# EAGLE schematic iob9bvrs (EAGLE 6.6.0)

## Sheet 1 of 7
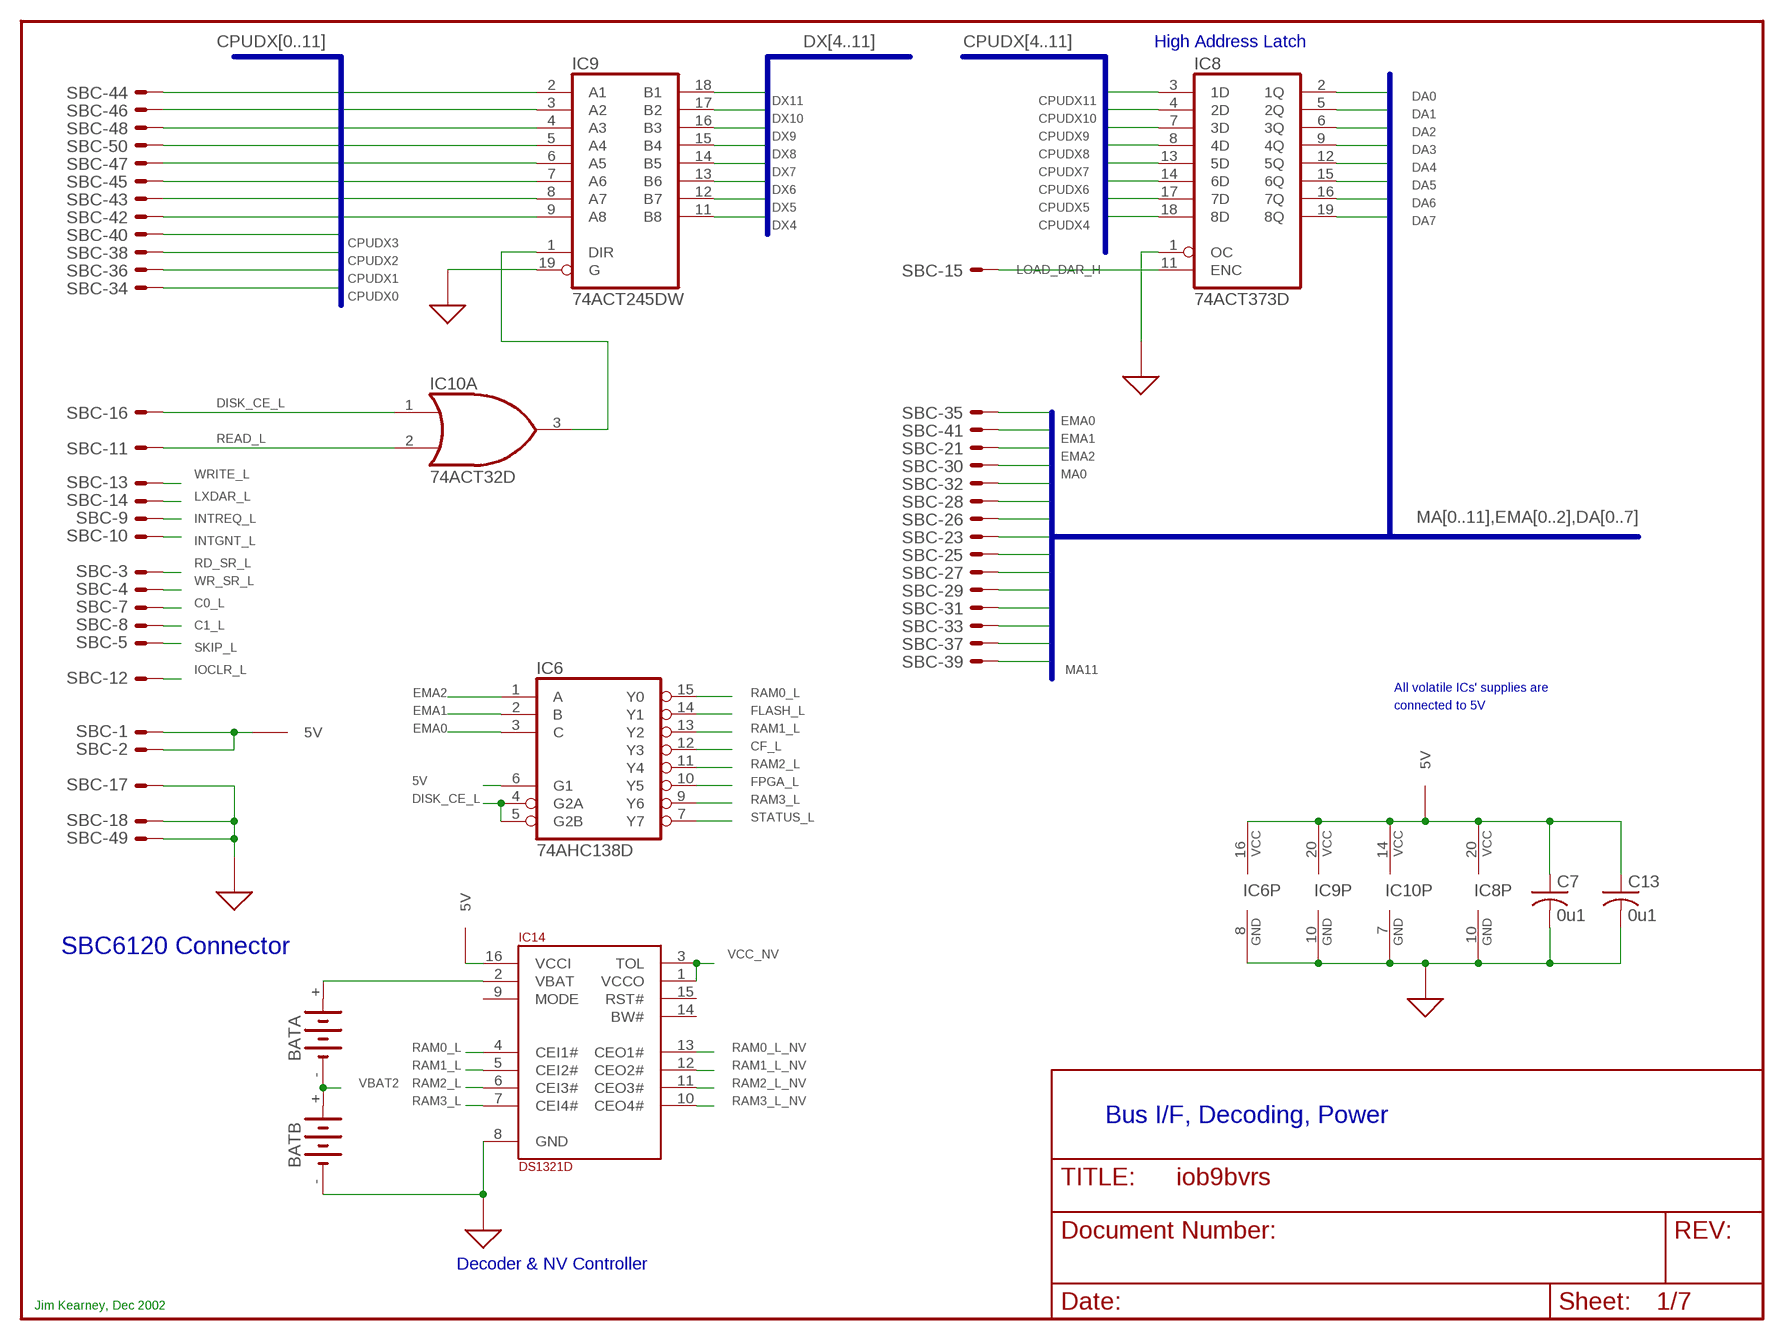
[diagram p0: schematic, sheet 1]

### Parts
BATA  CR2032HOLDER  [CR2032HOLDER]
BATB  CR2032HOLDER  [CR2032HOLDER]
C7  0u1  C-USC0805  [C0805]
C13  0u1  C-USC0805  [C0805]
IC6  74AHC138D  74LS138D  [SO16]
IC8  74ACT373D  74LS373DW  [SO20W]
IC9  74ACT245DW  74LS245DW  [SO20W]
IC10  74ACT32D  74LS32D  [SO14]
IC14  DS1321D  [SO16]
SBC  ML50E  [ML50]

### Nets
5V [power]: C7.1 C13.1 IC6.6(G1) IC6.16(VCC) IC8.20(VCC) IC9.20(VCC) IC10.14(P:VCC) IC14.16(VCCI) SBC.1 SBC.2 ; also sheet 2,3,4,5,6
C0_L: SBC.7 ; also sheet 4
C1_L: SBC.8 ; also sheet 4
CF_L: IC6.12(Y3) ; also sheet 3
CPUDX0: SBC.34 ; also sheet 4,5
CPUDX1: SBC.36 ; also sheet 4,5
CPUDX2: SBC.38 ; also sheet 4,5
CPUDX3: SBC.40 ; also sheet 4,5
CPUDX4: IC8.18(8D) IC9.9(A8) SBC.42 ; also sheet 3,5
CPUDX5: IC8.17(7D) IC9.8(A7) SBC.43 ; also sheet 3,5
CPUDX6: IC8.14(6D) IC9.7(A6) SBC.45 ; also sheet 3,5
CPUDX7: IC8.13(5D) IC9.6(A5) SBC.47 ; also sheet 3,5
CPUDX8: IC8.8(4D) IC9.5(A4) SBC.50 ; also sheet 3,5
CPUDX9: IC8.7(3D) IC9.4(A3) SBC.48 ; also sheet 3,5
CPUDX10: IC8.4(2D) IC9.3(A2) SBC.46 ; also sheet 3,5
CPUDX11: IC8.3(1D) IC9.2(A1) SBC.44 ; also sheet 3,5
DA0: IC8.2(1Q) ; also sheet 2
DA1: IC8.5(2Q) ; also sheet 2
DA2: IC8.6(3Q) ; also sheet 2
DA3: IC8.9(4Q) ; also sheet 2
DA4: IC8.12(5Q) ; also sheet 2
DA5: IC8.15(6Q) ; also sheet 2
DA6: IC8.16(7Q) ; also sheet 2
DA7: IC8.19(8Q)
DISK_CE_L: IC6.4(G2A) IC6.5(G2B) IC10.1(A:I0) SBC.16
DX4: IC9.11(B8) ; also sheet 2,3
DX5: IC9.12(B7) ; also sheet 2,3
DX6: IC9.13(B6) ; also sheet 2,3
DX7: IC9.14(B5) ; also sheet 2,3
DX8: IC9.15(B4) ; also sheet 2,3
DX9: IC9.16(B3) ; also sheet 2,3
DX10: IC9.17(B2) ; also sheet 2,3
DX11: IC9.18(B1) ; also sheet 2,3
EMA0: IC6.3(C) SBC.35
EMA1: IC6.2(B) SBC.41
EMA2: IC6.1(A) SBC.21
FLASH_L: IC6.14(Y1) ; also sheet 2
FPGA_L: IC6.10(Y5) ; also sheet 3
GND [gnd]: BATB.- C7.2 C13.2 IC6.8(GND) IC8.1(OC) IC8.10(GND) IC9.10(GND) IC9.19(G) IC10.7(P:GND) IC14.8(GND) SBC.17 SBC.18 SBC.49 ; also sheet 2,3,4,5,6,7
INTGNT_L: SBC.10 ; also sheet 4
INTREQ_L: SBC.9 ; also sheet 4
IOCLR_L: SBC.12 ; also sheet 2,4
LOAD_DAR_H: IC8.11(ENC) SBC.15
LXDAR_L: SBC.14 ; also sheet 4
MA0: SBC.30 ; also sheet 2
MA1: SBC.32 ; also sheet 2
MA2: SBC.28 ; also sheet 2
MA3: SBC.26 ; also sheet 2
MA4: SBC.23 ; also sheet 2
MA5: SBC.25 ; also sheet 2
MA6: SBC.27 ; also sheet 2
MA7: SBC.29 ; also sheet 2
MA8: SBC.31 ; also sheet 2
MA9: SBC.33 ; also sheet 2,3
MA10: SBC.37 ; also sheet 2,3
MA11: SBC.39 ; also sheet 2,3
N$2: BATA.+ IC14.2(VBAT)
N$91: IC9.1(DIR) IC10.3(A:O)
RAM0_L: IC6.15(Y0) IC14.4(CEI1#)
RAM0_L_NV: IC14.13(CEO1#) ; also sheet 2
RAM1_L: IC6.13(Y2) IC14.5(CEI2#)
RAM1_L_NV: IC14.12(CEO2#) ; also sheet 2
RAM2_L: IC6.11(Y4) IC14.6(CEI3#)
RAM2_L_NV: IC14.11(CEO3#) ; also sheet 2
RAM3_L: IC6.9(Y6) IC14.7(CEI4#)
RAM3_L_NV: IC14.10(CEO4#) ; also sheet 2
RD_SR_L: SBC.3 ; also sheet 4
READ_L: IC10.2(A:I1) SBC.11 ; also sheet 2,3,4
SKIP_L: SBC.5 ; also sheet 4
STATUS_L: IC6.7(Y7) ; also sheet 3
VBAT2: BATA.- BATB.+ ; also sheet 6
VCC_NV [power]: IC14.1(VCCO) IC14.3(TOL) ; also sheet 2
WR_SR_L: SBC.4 ; also sheet 4
WRITE_L: SBC.13 ; also sheet 2,3,4
Unconnected: IC14.9(MODE) IC14.14(BW#) IC14.15(RST#) SBC.6 SBC.19 SBC.20 SBC.22 SBC.24

### Buses
DX[4..11]
MA[0..11],EMA[0..2],DA[0..7]
CPUDX[0..11]
CPUDX[4..11]

### Notes on the sheet
- High Address Latch
- All volatile ICs' supplies are
- connected to 5V
- SBC6120 Connector
- Bus I/F, Decoding, Power
- Decoder & NV Controller
- Jim Kearney, Dec 2002

## Sheet 2 of 7
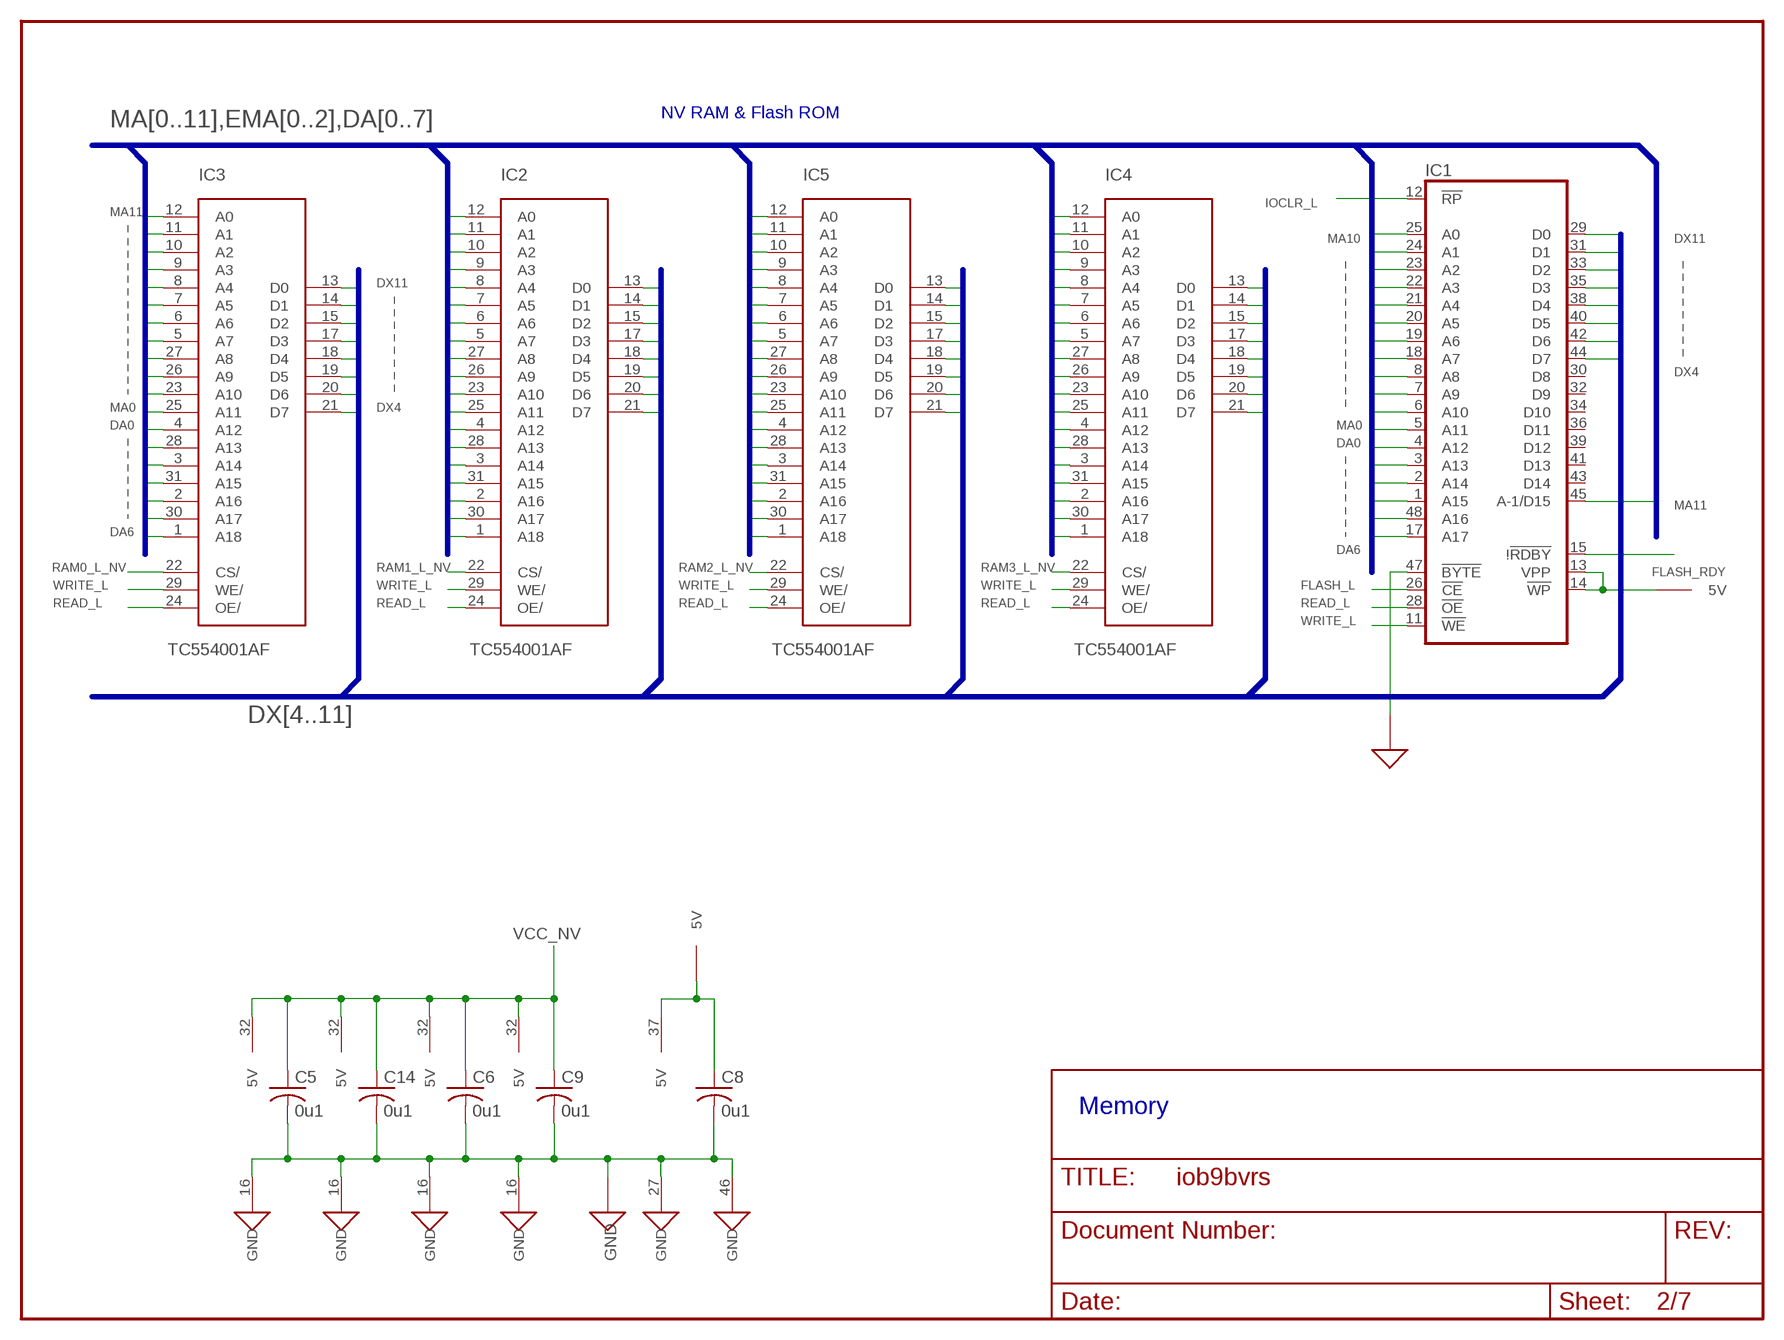
[diagram p1: schematic, sheet 2]

### Parts
C5  0u1  C-USC0805  [C0805]
C6  0u1  C-USC0805  [C0805]
C8  0u1  C-USC0805  [C0805]
C9  0u1  C-USC0805  [C0805]
C14  0u1  C-USC0805  [C0805]
IC1  LH28F400BVHE-BL  LH28F400  [TSOP48]
IC2  TC554001AF  [SOP32]
IC3  TC554001AF  [SOP32]
IC4  TC554001AF  [SOP32]
IC5  TC554001AF  [SOP32]

### Nets
5V [power]: C8.1 IC1.13(VPP) IC1.14(!WP) IC1.37(5V) ; also sheet 1,3,4,5,6
DA0: IC1.5(A11) IC2.4(A12) IC3.4(A12) IC4.4(A12) IC5.4(A12) ; also sheet 1
DA1: IC1.4(A12) IC2.28(A13) IC3.28(A13) IC4.28(A13) IC5.28(A13) ; also sheet 1
DA2: IC1.3(A13) IC2.3(A14) IC3.3(A14) IC4.3(A14) IC5.3(A14) ; also sheet 1
DA3: IC1.2(A14) IC2.31(A15) IC3.31(A15) IC4.31(A15) IC5.31(A15) ; also sheet 1
DA4: IC1.1(A15) IC2.2(A16) IC3.2(A16) IC4.2(A16) IC5.2(A16) ; also sheet 1
DA5: IC1.48(A16) IC2.30(A17) IC3.30(A17) IC4.30(A17) IC5.30(A17) ; also sheet 1
DA6: IC1.17(A17) IC2.1(A18) IC3.1(A18) IC4.1(A18) IC5.1(A18) ; also sheet 1
DX4: IC1.44(D7) IC2.21(D7) IC3.21(D7) IC4.21(D7) IC5.21(D7) ; also sheet 1,3
DX5: IC1.42(D6) IC2.20(D6) IC3.20(D6) IC4.20(D6) IC5.20(D6) ; also sheet 1,3
DX6: IC1.40(D5) IC2.19(D5) IC3.19(D5) IC4.19(D5) IC5.19(D5) ; also sheet 1,3
DX7: IC1.38(D4) IC2.18(D4) IC3.18(D4) IC4.18(D4) IC5.18(D4) ; also sheet 1,3
DX8: IC1.35(D3) IC2.17(D3) IC3.17(D3) IC4.17(D3) IC5.17(D3) ; also sheet 1,3
DX9: IC1.33(D2) IC2.15(D2) IC3.15(D2) IC4.15(D2) IC5.15(D2) ; also sheet 1,3
DX10: IC1.31(D1) IC2.14(D1) IC3.14(D1) IC4.14(D1) IC5.14(D1) ; also sheet 1,3
DX11: IC1.29(D0) IC2.13(D0) IC3.13(D0) IC4.13(D0) IC5.13(D0) ; also sheet 1,3
FLASH_L: IC1.26(!CE) ; also sheet 1
FLASH_RDY: IC1.15(!!RDBY) ; also sheet 3
GND [gnd]: C5.2 C6.2 C8.2 C9.2 C14.2 IC1.27(GND) IC1.46(GND) IC1.47(!BYTE) IC2.16(GND) IC3.16(GND) IC4.16(GND) IC5.16(GND) ; also sheet 1,3,4,5,6,7
IOCLR_L: IC1.12(!RP) ; also sheet 1,4
MA0: IC1.6(A10) IC2.25(A11) IC3.25(A11) IC4.25(A11) IC5.25(A11) ; also sheet 1
MA1: IC1.7(A9) IC2.23(A10) IC3.23(A10) IC4.23(A10) IC5.23(A10) ; also sheet 1
MA2: IC1.8(A8) IC2.26(A9) IC3.26(A9) IC4.26(A9) IC5.26(A9) ; also sheet 1
MA3: IC1.18(A7) IC2.27(A8) IC3.27(A8) IC4.27(A8) IC5.27(A8) ; also sheet 1
MA4: IC1.19(A6) IC2.5(A7) IC3.5(A7) IC4.5(A7) IC5.5(A7) ; also sheet 1
MA5: IC1.20(A5) IC2.6(A6) IC3.6(A6) IC4.6(A6) IC5.6(A6) ; also sheet 1
MA6: IC1.21(A4) IC2.7(A5) IC3.7(A5) IC4.7(A5) IC5.7(A5) ; also sheet 1
MA7: IC1.22(A3) IC2.8(A4) IC3.8(A4) IC4.8(A4) IC5.8(A4) ; also sheet 1
MA8: IC1.23(A2) IC2.9(A3) IC3.9(A3) IC4.9(A3) IC5.9(A3) ; also sheet 1
MA9: IC1.24(A1) IC2.10(A2) IC3.10(A2) IC4.10(A2) IC5.10(A2) ; also sheet 1,3
MA10: IC1.25(A0) IC2.11(A1) IC3.11(A1) IC4.11(A1) IC5.11(A1) ; also sheet 1,3
MA11: IC1.45(A-1/D15) IC2.12(A0) IC3.12(A0) IC4.12(A0) IC5.12(A0) ; also sheet 1,3
RAM0_L_NV: IC3.22(CS/) ; also sheet 1
RAM1_L_NV: IC2.22(CS/) ; also sheet 1
RAM2_L_NV: IC5.22(CS/) ; also sheet 1
RAM3_L_NV: IC4.22(CS/) ; also sheet 1
READ_L: IC1.28(!OE) IC2.24(OE/) IC3.24(OE/) IC4.24(OE/) IC5.24(OE/) ; also sheet 1,3,4
VCC_NV [power]: C5.1 C6.1 C9.1 C14.1 IC2.32(5V) IC3.32(5V) IC4.32(5V) IC5.32(5V) ; also sheet 1
WRITE_L: IC1.11(!WE) IC2.29(WE/) IC3.29(WE/) IC4.29(WE/) IC5.29(WE/) ; also sheet 1,3,4
Unconnected: IC1.30(D8) IC1.32(D9) IC1.34(D10) IC1.36(D11) IC1.39(D12) IC1.41(D13) IC1.43(D14)

### Buses
MA[0..11],EMA[0..2],DA[0..7]
DX[4..11]

### Notes on the sheet
- NV RAM & Flash ROM
- Memory

## Sheet 3 of 7
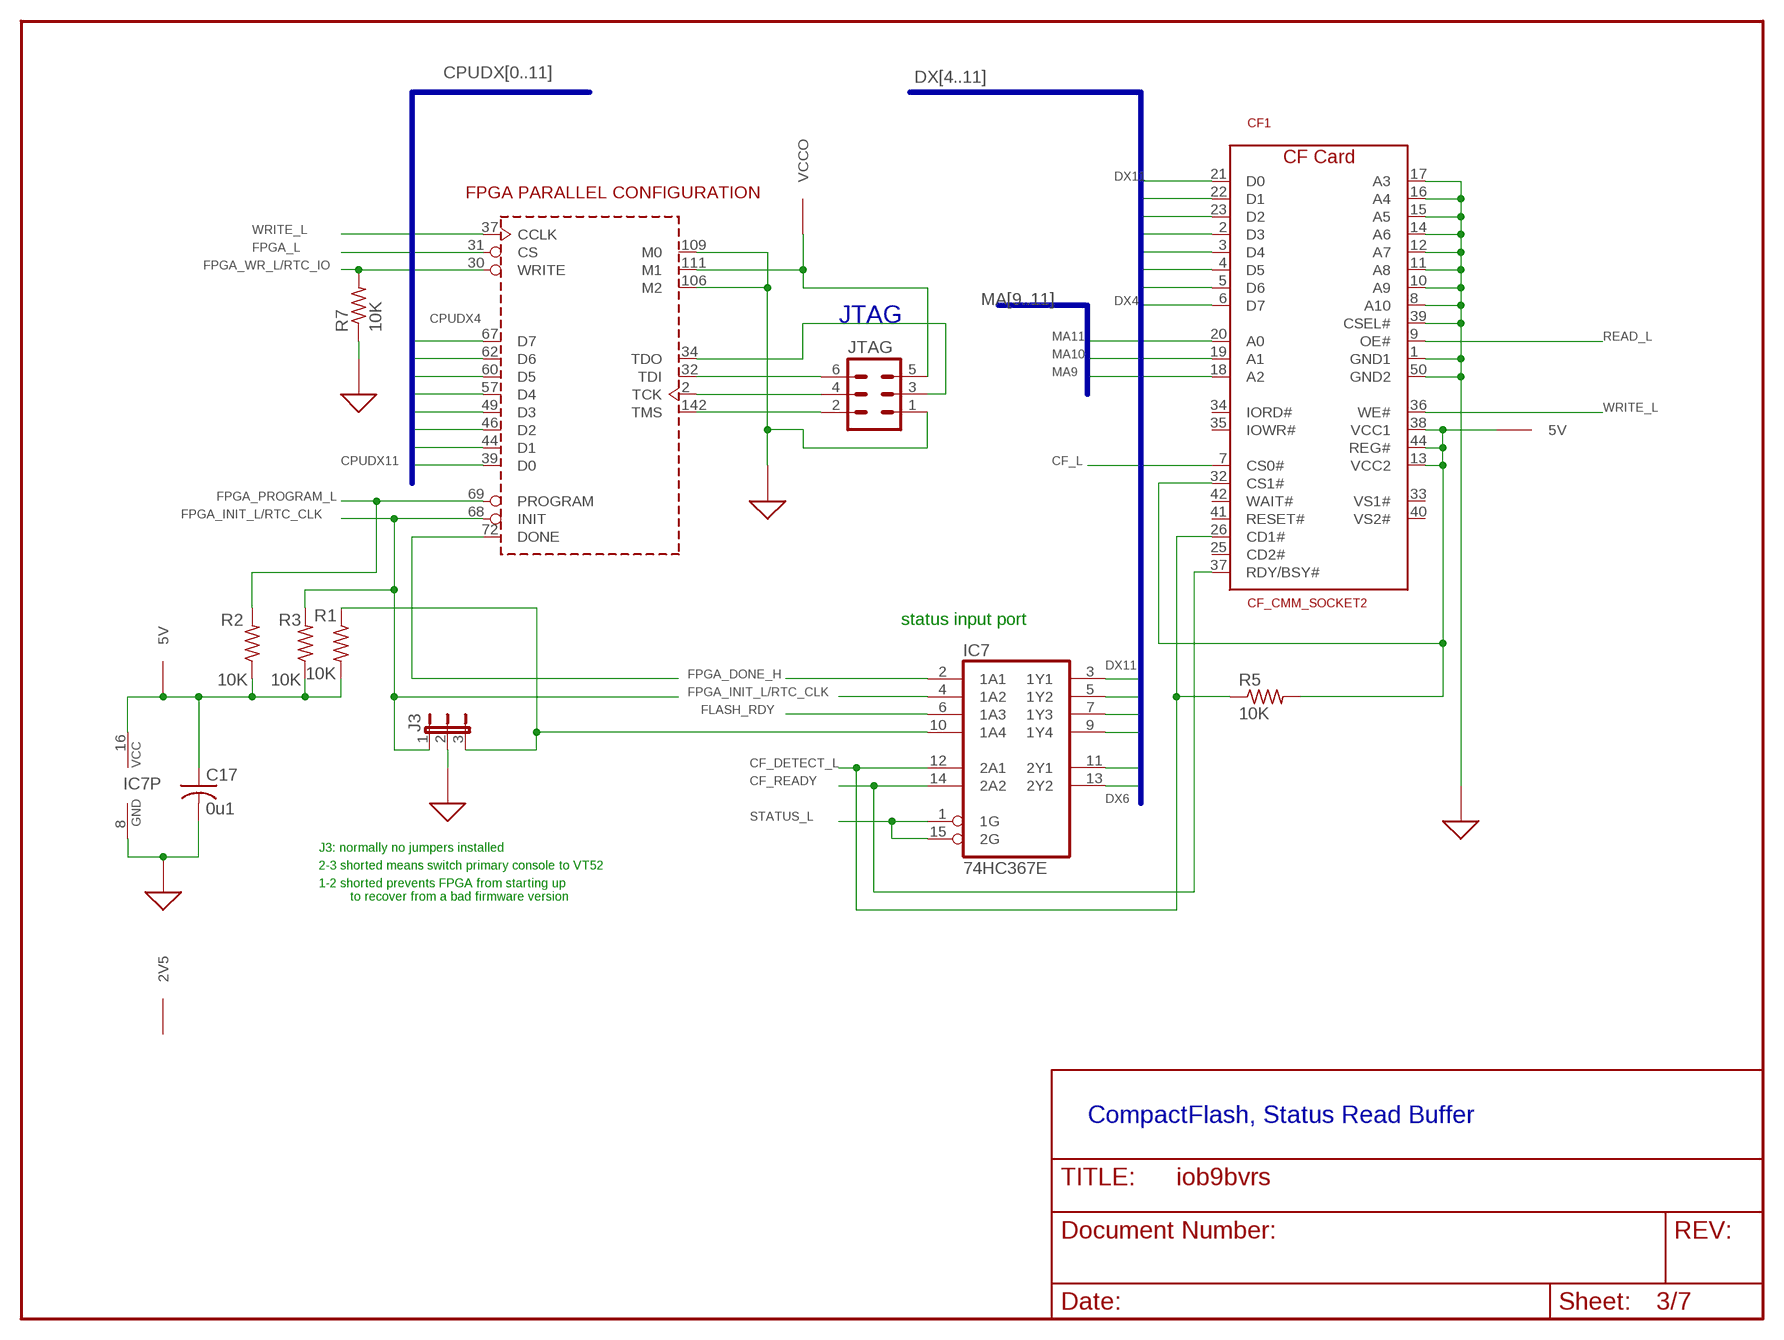
[diagram p2: schematic, sheet 3]

### Parts
C17  0u1  C-USC0805  [C0805]
CF1  CF_CMM_SOCKET2  [CF_SOCKET2_SMT]
IC7  74HC367E  74HCT367E  [SOP16]
IC12  XC2S30-IOB1-5TQ144  [TQFP144]
J3  JP2E  [JP2]
JTAG  MA03-2  [MA03-2]
R1  10K  R-US_M0805  [M0805]
R2  10K  R-US_M0805  [M0805]
R3  10K  R-US_M0805  [M0805]
R5  10K  R-US_R0805  [R0805]
R7  10K  R-US_M0805  [M0805]

### Nets
5V [power]: C17.1 CF1.13(VCC2) CF1.32(CS1#) CF1.38(VCC1) CF1.44(REG#) IC7.16(VCC) R1.2 R2.1 R3.1 R5.2 ; also sheet 1,2,4,5,6
CF_DETECT_L: CF1.26(CD1#) IC7.12(2A1) R5.1
CF_L: CF1.7(CS0#) ; also sheet 1
CF_READY: CF1.37(RDY/BSY#) IC7.14(2A2)
CPUDX4: IC12.67(D7) ; also sheet 1,5
CPUDX5: IC12.62(D6) ; also sheet 1,5
CPUDX6: IC12.60(D5) ; also sheet 1,5
CPUDX7: IC12.57(D4) ; also sheet 1,5
CPUDX8: IC12.49(D3) ; also sheet 1,5
CPUDX9: IC12.46(D2) ; also sheet 1,5
CPUDX10: IC12.44(D1) ; also sheet 1,5
CPUDX11: IC12.39(D0) ; also sheet 1,5
DX4: CF1.6(D7) ; also sheet 1,2
DX5: CF1.5(D6) ; also sheet 1,2
DX6: CF1.4(D5) IC7.13(2Y2) ; also sheet 1,2
DX7: CF1.3(D4) IC7.11(2Y1) ; also sheet 1,2
DX8: CF1.2(D3) IC7.9(1Y4) ; also sheet 1,2
DX9: CF1.23(D2) IC7.7(1Y3) ; also sheet 1,2
DX10: CF1.22(D1) IC7.5(1Y2) ; also sheet 1,2
DX11: CF1.21(D0) IC7.3(1Y1) ; also sheet 1,2
FLASH_RDY: IC7.6(1A3) ; also sheet 2
FPGA_DONE_H: IC7.2(1A1) IC12.72(DONE)
FPGA_INIT_L/RTC_CLK: IC7.4(1A2) IC12.68(INIT) J3.1 R3.2 ; also sheet 6
FPGA_L: IC12.31(CS) ; also sheet 1
FPGA_PROGRAM_L: IC12.69(PROGRAM) R2.2 ; also sheet 4
FPGA_WR_L/RTC_IO: IC12.30(WRITE) R7.2 ; also sheet 6
GND [gnd]: C17.2 CF1.1(GND1) CF1.8(A10) CF1.10(A9) CF1.11(A8) CF1.12(A7) CF1.14(A6) CF1.15(A5) CF1.16(A4) CF1.17(A3) CF1.39(CSEL#) CF1.50(GND2) IC7.8(GND) IC12.106(M2) IC12.109(M0) J3.2 JTAG.1 R7.1 ; also sheet 1,2,4,5,6,7
MA9: CF1.18(A2) ; also sheet 1,2
MA10: CF1.19(A1) ; also sheet 1,2
MA11: CF1.20(A0) ; also sheet 1,2
N$3: IC7.10(1A4) J3.3 R1.1
READ_L: CF1.9(OE#) ; also sheet 1,2,4
STATUS_L: IC7.1(1G) IC7.15(2G) ; also sheet 1
TCK: IC12.2(TCK) JTAG.4
TDI: IC12.32(TDI) JTAG.6
TDO: IC12.34(TDO) JTAG.3
TMS: IC12.142(TMS) JTAG.2
VCCO [power2]: IC12.111(M1) JTAG.5 ; also sheet 4
WRITE_L: CF1.36(WE#) IC12.37(CCLK) ; also sheet 1,2,4
Unconnected: CF1.25(CD2#) CF1.33(VS1#) CF1.34(IORD#) CF1.35(IOWR#) CF1.40(VS2#) CF1.41(RESET#) CF1.42(WAIT#)

### Buses
DX[4..11]
MA[9..11]
CPUDX[0..11]

### Notes on the sheet
- JTAG
- status input port
- J3: normally no jumpers installed
- 2-3 shorted means switch primary console to VT52
- 1-2 shorted prevents FPGA from starting up
- to recover from a bad firmware version
- CompactFlash, Status Read Buffer

## Sheet 4 of 7
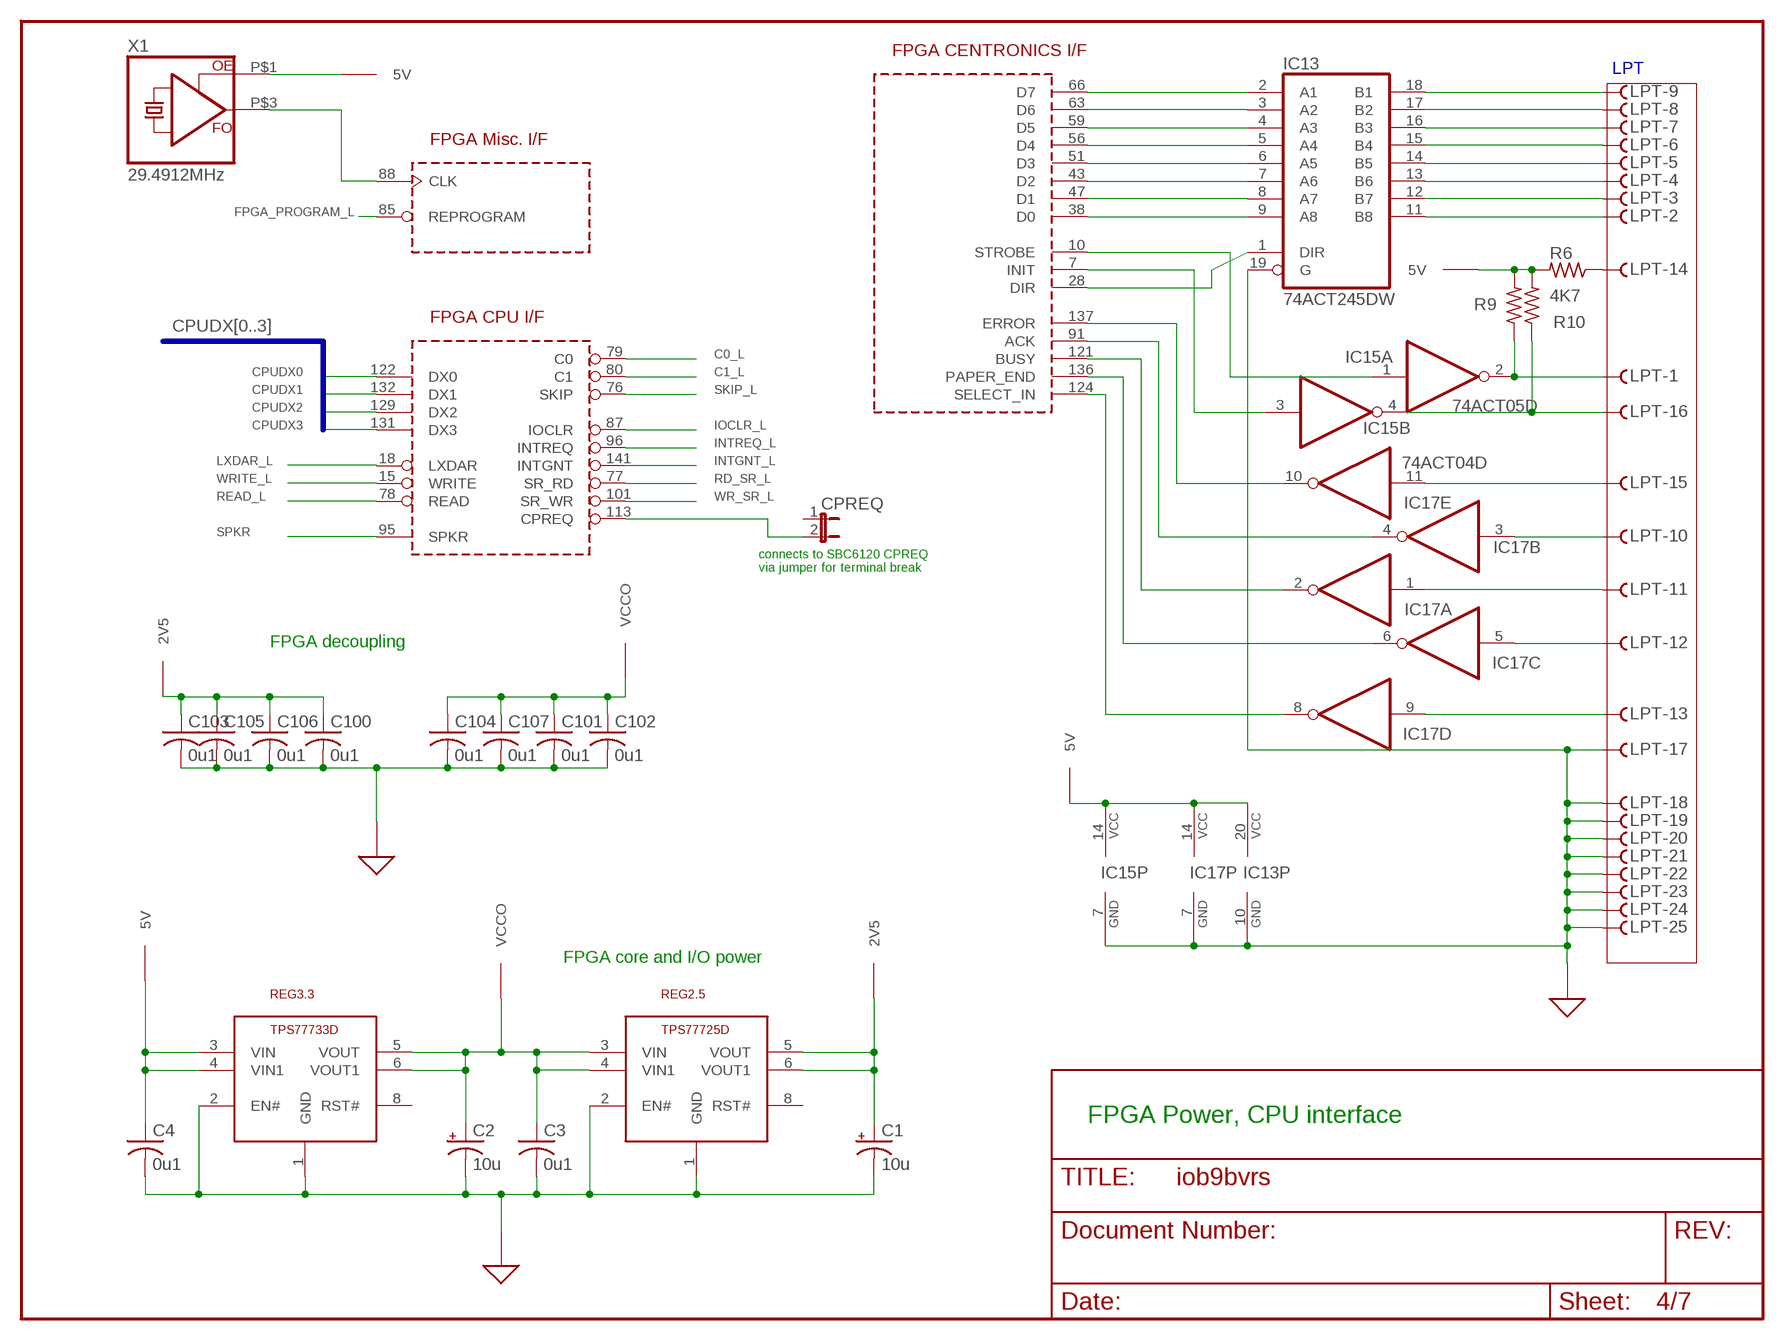
[diagram p3: schematic, sheet 4]

### Parts
C1  10u  CPOL-US085CS-1AR  [085CS_1AR]
C2  10u  CPOL-US085CS-1AR  [085CS_1AR]
C3  0u1  C-USC0805  [C0805]
C4  0u1  C-USC0805  [C0805]
C100  0u1  C-USC0805  [C0805]
C101  0u1  C-USC0805  [C0805]
C102  0u1  C-USC0805  [C0805]
C103  0u1  C-USC0805  [C0805]
C104  0u1  C-USC0805  [C0805]
C105  0u1  C-USC0805  [C0805]
C106  0u1  C-USC0805  [C0805]
C107  0u1  C-USC0805  [C0805]
CPREQ  JP1E  [JP1]
IC13  74ACT245DW  74LS245DW  [SO20W]
IC15  74ACT05D  74ALS05D  [SO14]
IC17  74ACT04D  74ALS04D  [SO14]
LPT  F25HS  [F25H]
R6  4K7  R-US_M0805  [M0805]
R9  4K7  R-US_M0805  [M0805]
R10  4K7  R-US_M0805  [M0805]
REG2.5  TPS77725D  TPS77XXXD  [SO08]
REG3.3  TPS77733D  TPS77XXXD  [SO08]
X1  29.4912MHz  OSC-OE-5V  [SG636]

### Nets
2V5 [power2]: C1.+ C100.1 C103.1 C105.1 C106.1 REG2.5.5(VOUT) REG2.5.6(VOUT1)
5V [power]: C4.1 IC13.20(VCC) IC15.14(P:VCC) IC17.14(P:VCC) R6.2 R9.2 R10.2 REG3.3.3(VIN) REG3.3.4(VIN1) X1.P$1(OE) ; also sheet 1,2,3,5,6
C0_L: IC12.79(C0) ; also sheet 1
C1_L: IC12.80(C1) ; also sheet 1
CPUDX0: IC12.122(DX0) ; also sheet 1,5
CPUDX1: IC12.132(DX1) ; also sheet 1,5
CPUDX2: IC12.129(DX2) ; also sheet 1,5
CPUDX3: IC12.131(DX3) ; also sheet 1,5
FPGA_PROGRAM_L: IC12.85(REPROGRAM) ; also sheet 3
GND [gnd]: C1.- C2.- C3.2 C4.2 C100.2 C101.2 C102.2 C103.2 C104.2 C105.2 C106.2 C107.2 IC13.10(GND) IC13.19(G) IC15.7(P:GND) IC17.7(P:GND) LPT.17 LPT.18 LPT.19 LPT.20 LPT.21 LPT.22 LPT.23 LPT.24 LPT.25 REG2.5.1(GND) REG2.5.2(EN#) REG3.3.1(GND) REG3.3.2(EN#) ; also sheet 1,2,3,5,6,7
INTGNT_L: IC12.141(INTGNT) ; also sheet 1
INTREQ_L: IC12.96(INTREQ) ; also sheet 1
IOCLR_L: IC12.87(IOCLR) ; also sheet 1,2
LXDAR_L: IC12.18(LXDAR) ; also sheet 1
N$1: IC12.66(D7) IC13.2(A1)
N$4: IC12.63(D6) IC13.3(A2)
N$5: IC12.59(D5) IC13.4(A3)
N$6: IC12.56(D4) IC13.5(A4)
N$7: IC12.88(CLK) X1.P$3(FO)
N$10: IC12.51(D3) IC13.6(A5)
N$15: IC12.43(D2) IC13.7(A6)
N$16: IC12.47(D1) IC13.8(A7)
N$17: IC12.38(D0) IC13.9(A8)
N$18: IC12.28(DIR) IC13.1(DIR)
N$19: IC12.7(INIT) IC15.3(B:I)
N$20: IC12.10(STROBE) IC15.1(A:I)
N$21: IC12.137(ERROR) IC17.10(E:O)
N$22: IC12.91(ACK) IC17.4(B:O)
N$23: IC12.121(BUSY) IC17.2(A:O)
N$24: IC12.136(PAPER_END) IC17.6(C:O)
N$25: IC12.124(SELECT_IN) IC17.8(D:O)
N$26: IC13.18(B1) LPT.9
N$27: IC13.17(B2) LPT.8
N$28: IC13.16(B3) LPT.7
N$29: IC13.15(B4) LPT.6
N$30: IC13.14(B5) LPT.5
N$31: IC13.13(B6) LPT.4
N$32: IC13.12(B7) LPT.3
N$33: IC13.11(B8) LPT.2
N$34: IC15.2(A:O) LPT.1 R9.1
N$35: IC15.4(B:O) LPT.16 R10.1
N$36: IC17.11(E:I) LPT.15
N$37: IC17.3(B:I) LPT.10
N$38: IC17.1(A:I) LPT.11
N$39: IC17.5(C:I) LPT.12
N$40: IC17.9(D:I) LPT.13
N$52: LPT.14 R6.1
N$86: CPREQ.2 IC12.113(CPREQ)
RD_SR_L: IC12.77(SR_RD) ; also sheet 1
READ_L: IC12.78(READ) ; also sheet 1,2,3
SKIP_L: IC12.76(SKIP) ; also sheet 1
SPKR: IC12.95(SPKR) ; also sheet 6
VCCO [power2]: C2.+ C3.1 C101.1 C102.1 C104.1 C107.1 REG2.5.3(VIN) REG2.5.4(VIN1) REG3.3.5(VOUT) REG3.3.6(VOUT1) ; also sheet 3
WR_SR_L: IC12.101(SR_WR) ; also sheet 1
WRITE_L: IC12.15(WRITE) ; also sheet 1,2,3
Unconnected: CPREQ.1 REG2.5.8(RST#) REG3.3.8(RST#)

### Buses
CPUDX[0..3]

### Notes on the sheet
- LPT
- connects to SBC6120 CPREQ
- via jumper for terminal break
- FPGA decoupling
- FPGA core and I/O power
- FPGA Power, CPU interface

## Sheet 5 of 7
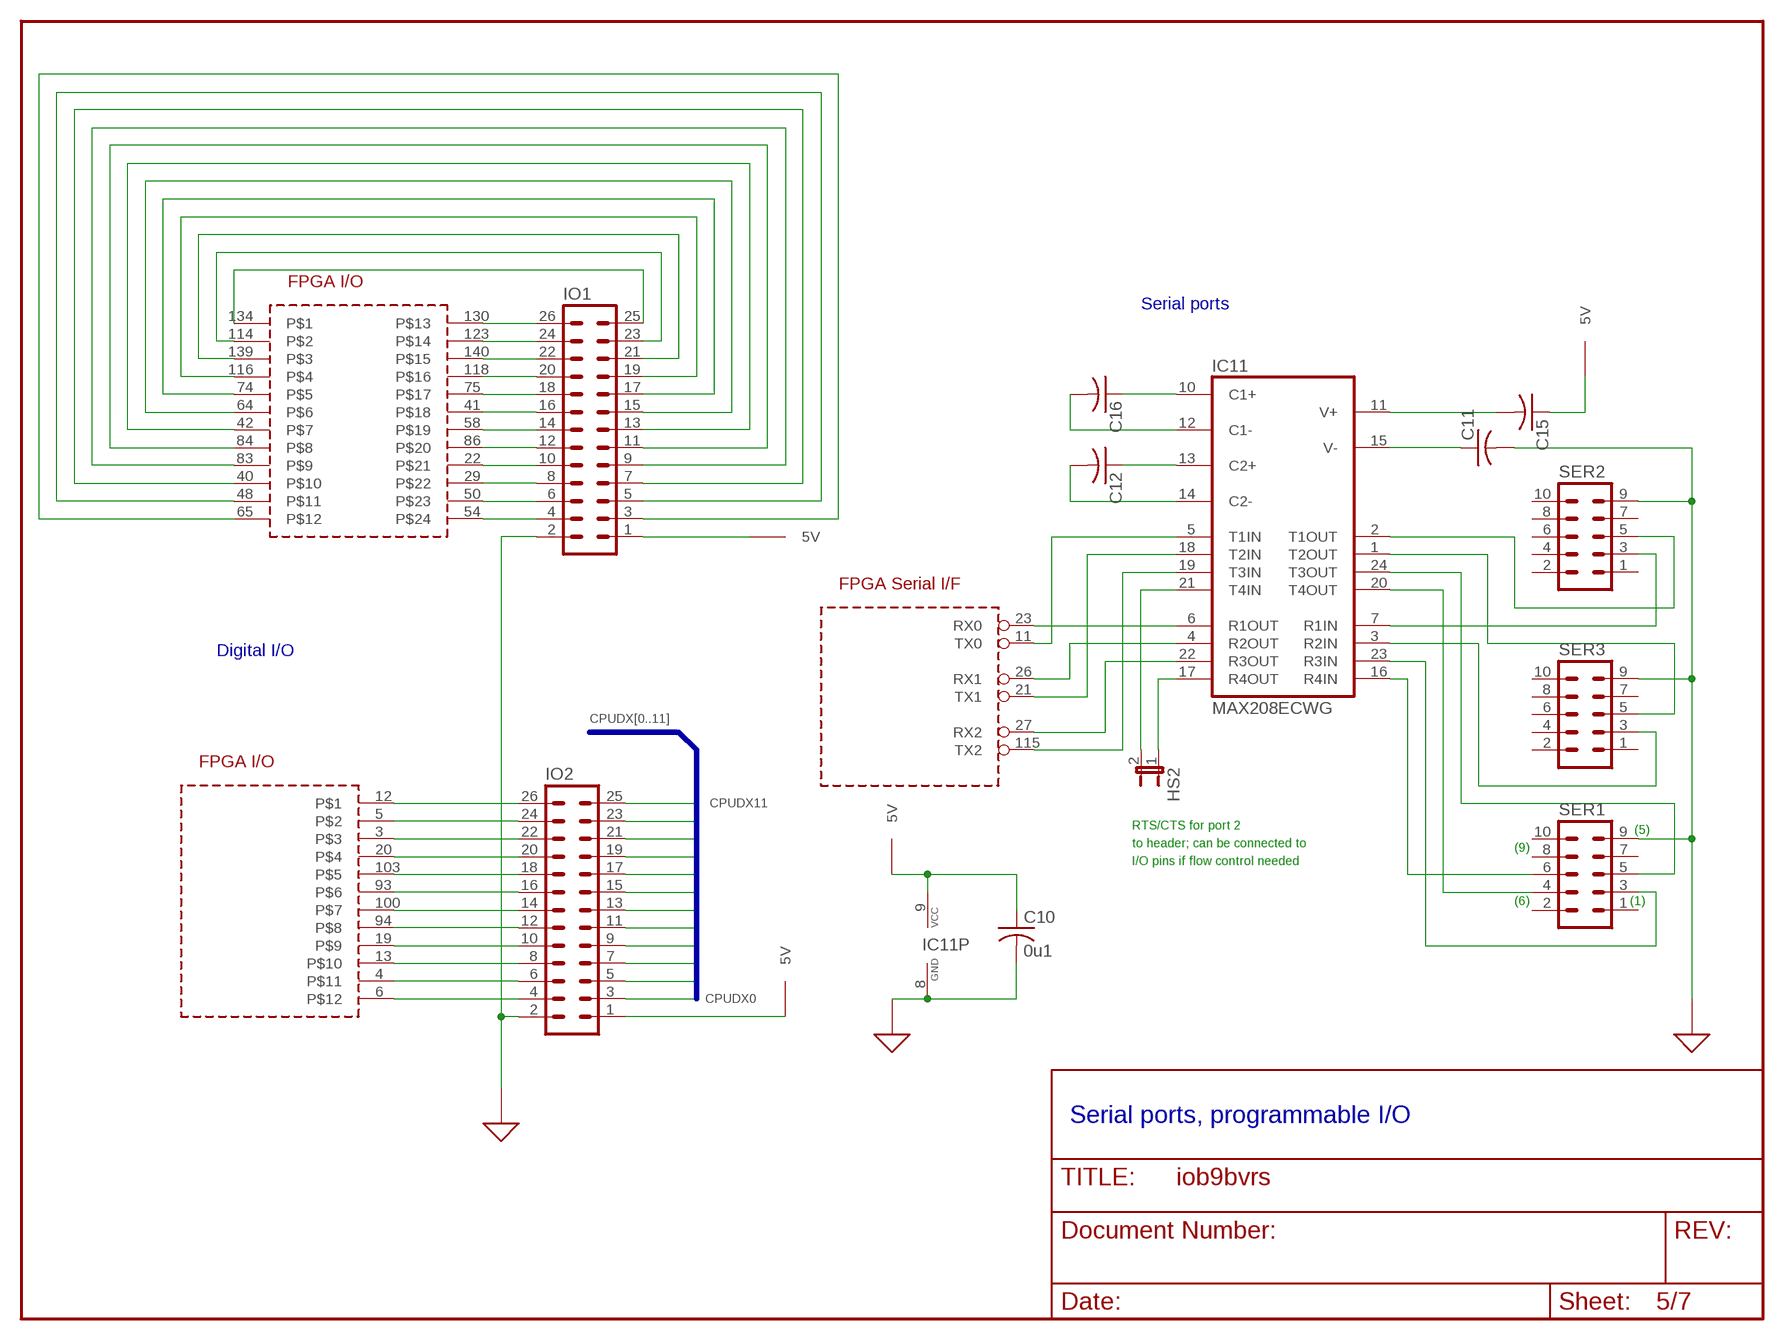
[diagram p4: schematic, sheet 5]

### Parts
C10  0u1  C-USC0805  [C0805]
C11  C-USC1206  [C1206]
C12  C-USC1206  [C1206]
C15  C-USC1206  [C1206]
C16  C-USC1206  [C1206]
HS2  JP1E  [JP1]
IC11  MAX208ECWG  [SO24L]
IO1  MA13-2  [MA13-2]
IO2  MA13-2  [MA13-2]
SER1  ML10  [ML10]
SER2  ML10  [ML10]
SER3  ML10  [ML10]

### Nets
5V [power]: C10.1 C15.1 IC11.9(VCC) IO1.1 IO2.1 ; also sheet 1,2,3,4,6
CPUDX0: IO2.3 ; also sheet 1,4
CPUDX1: IO2.5 ; also sheet 1,4
CPUDX2: IO2.7 ; also sheet 1,4
CPUDX3: IO2.9 ; also sheet 1,4
CPUDX4: IO2.11 ; also sheet 1,3
CPUDX5: IO2.13 ; also sheet 1,3
CPUDX6: IO2.15 ; also sheet 1,3
CPUDX7: IO2.17 ; also sheet 1,3
CPUDX8: IO2.19 ; also sheet 1,3
CPUDX9: IO2.21 ; also sheet 1,3
CPUDX10: IO2.23 ; also sheet 1,3
CPUDX11: IO2.25 ; also sheet 1,3
CTS2: HS2.1 IC11.17(R4OUT)
GND [gnd]: C10.2 C11.2 IC11.8(GND) IO1.2 IO2.2 SER1.9 SER2.9 SER3.9 ; also sheet 1,2,3,4,6,7
N$41: IC12.130 IO1.26
N$42: IC12.123 IO1.24
N$43: IC12.140 IO1.22
N$44: IC12.118 IO1.20
N$45: IC12.75 IO1.18
N$46: IC12.41 IO1.16
N$47: IC12.58 IO1.14
N$48: IC12.86 IO1.12
N$49: IC12.22 IO1.10
N$50: IC12.29 IO1.8
N$51: IC12.50 IO1.6
N$53: IC12.54 IO1.4
N$54: IC12.134 IO1.25
N$55: IC12.114 IO1.23
N$56: IC12.139 IO1.21
N$57: IC12.116 IO1.19
N$58: IC12.74 IO1.17
N$59: IC12.64 IO1.15
N$60: IC12.42 IO1.13
N$61: IC12.84 IO1.11
N$62: IC12.83 IO1.9
N$63: IC12.40 IO1.7
N$64: IC12.48 IO1.5
N$65: IC12.65 IO1.3
N$66: IC12.12 IO2.26
N$67: IC12.5 IO2.24
N$71: IC12.3 IO2.22
N$72: IC12.20 IO2.20
N$73: IC12.103 IO2.18
N$74: IC12.93 IO2.16
N$75: IC12.100 IO2.14
N$76: IC11.16(R4IN) SER1.6
N$77: IC12.94 IO2.12
N$78: IC12.19 IO2.10
N$79: IC12.13 IO2.8
N$80: IC12.4 IO2.6
N$81: IC12.6 IO2.4
N$92: IC11.6(R1OUT) IC12.23(RX0)
N$93: IC11.5(T1IN) IC12.11(TX0)
N$94: IC11.4(R2OUT) IC12.26(RX1)
N$95: IC11.18(T2IN) IC12.21(TX1)
N$96: IC11.22(R3OUT) IC12.27(RX2)
N$97: IC11.19(T3IN) IC12.115(TX2)
N$101: C16.1 IC11.10(C1+)
N$102: C16.2 IC11.12(C1-)
N$103: C12.1 IC11.13(C2+)
N$104: C12.2 IC11.14(C2-)
N$105: C15.2 IC11.11(V+)
N$107: C11.1 IC11.15(V-)
N$110: IC11.7(R1IN) SER2.3
N$112: IC11.3(R2IN) SER3.3
N$113: IC11.24(T3OUT) SER1.5
N$114: IC11.23(R3IN) SER1.3
RTS2: HS2.2 IC11.21(T4IN)
TX0: IC11.2(T1OUT) SER2.5
TX1: IC11.1(T2OUT) SER3.5
TX2: IC11.20(T4OUT) SER1.4
Unconnected: SER1.1 SER1.2 SER1.7 SER1.8 SER1.10 SER2.1 SER2.2 SER2.4 SER2.6 SER2.7 SER2.8 SER2.10 SER3.1 SER3.2 SER3.4 SER3.6 SER3.7 SER3.8 SER3.10

### Buses
CPUDX[0..11]

### Notes on the sheet
- Serial ports
- Digital I/O
- RTS/CTS for port 2
- (5)
- to header; can be connected to
- (9)
- I/O pins if flow control needed
- (6) | (1)
- Serial ports, programmable I/O

## Sheet 6 of 7
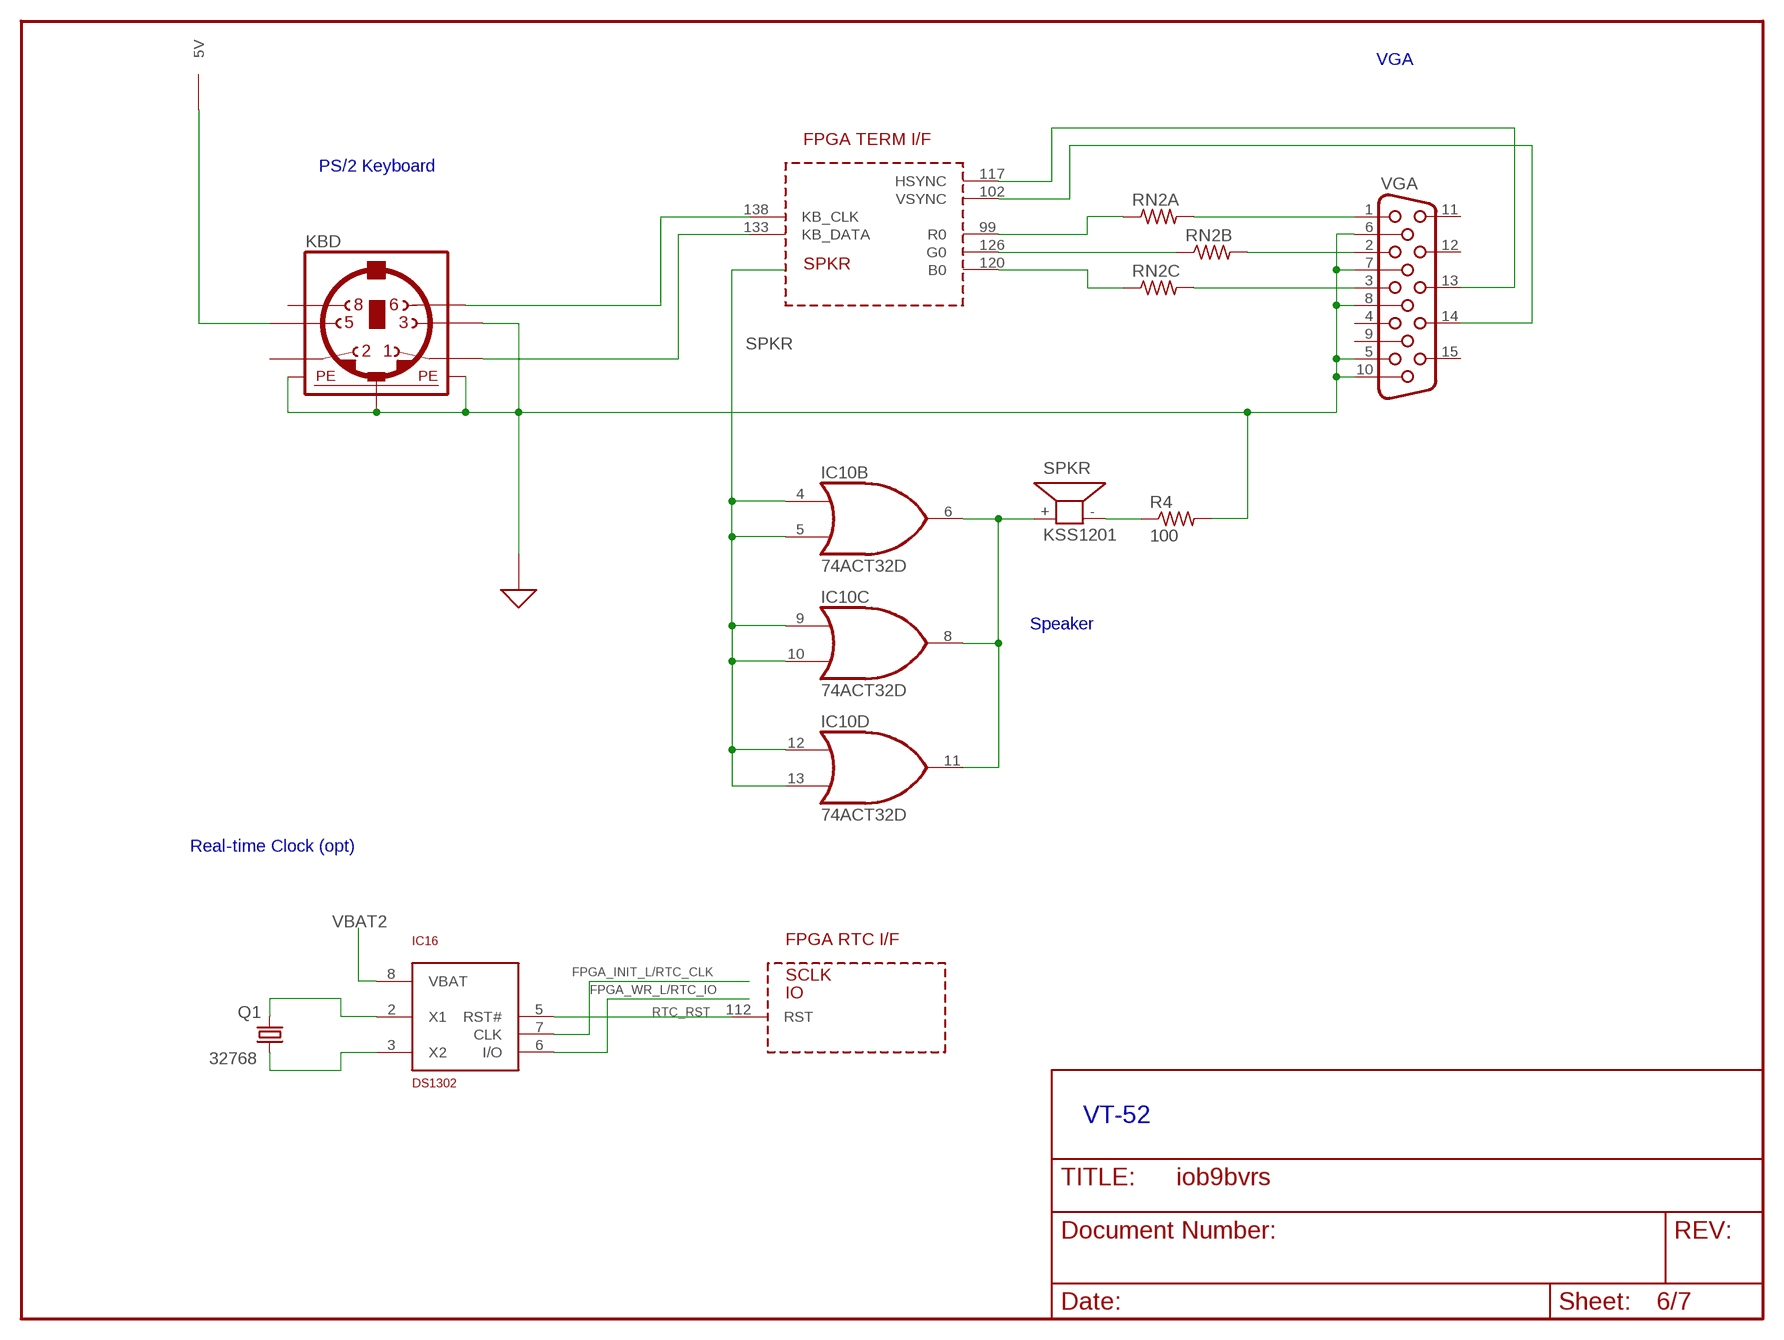
[diagram p5: schematic, sheet 6]

### Parts
IC16  DS1302  [SO08]
KBD  MINI_DIN_6  [M_DIN6]
Q1  32768  CRYTALTC26H  [TC26H]
R4  100  R-US_M1206  [M1206]
RN2  RN-4-SMT  [RN-CTS-744C043]
SPKR  KSS1201  [KSS1201]
VGA  HF15H  [HDF15H]

### Nets
5V [power]: KBD.5 ; also sheet 1,2,3,4,5
B0: IC12.120(B0) RN2.3
FPGA_INIT_L/RTC_CLK: IC16.7(CLK) ; also sheet 3
FPGA_WR_L/RTC_IO: IC16.6(I/O) ; also sheet 3
G0: IC12.126(G0) RN2.2
GND [gnd]: KBD.3 KBD.SH1(PE1) KBD.SH2(PE2) KBD.SH3(PE3) R4.2 VGA.5 VGA.6 VGA.7 VGA.8 VGA.10 ; also sheet 1,2,3,4,5,7
HS: IC12.117(HSYNC) VGA.13
KB_CLK: IC12.138(KB_CLK) KBD.6
KB_DATA: IC12.133(KB_DATA) KBD.1
N$8: IC16.3(X2) Q1.1
N$68: RN2.8 VGA.1
N$69: RN2.7 VGA.2
N$70: RN2.6 VGA.3
N$82: IC16.2(X1) Q1.2
N$106: R4.1 SPKR.-
R0: IC12.99(R0) RN2.1
RTC_RST: IC12.112(RST) IC16.5(RST#)
SPEAKER: IC10.6(B:O) IC10.8(C:O) IC10.11(D:O) SPKR.+
SPKR: IC10.4(B:I0) IC10.5(B:I1) IC10.9(C:I0) IC10.10(C:I1) IC10.12(D:I0) IC10.13(D:I1) ; also sheet 4
VBAT2: IC16.8(VBAT) ; also sheet 1
VS: IC12.102(VSYNC) VGA.14
Unconnected: KBD.2 KBD.8 RN2.4 RN2.5 VGA.4 VGA.9 VGA.11 VGA.12 VGA.15

### Notes on the sheet
- VGA
- PS/2 Keyboard
- Speaker
- Real-time Clock (opt)
- VT-52

## Sheet 7 of 7
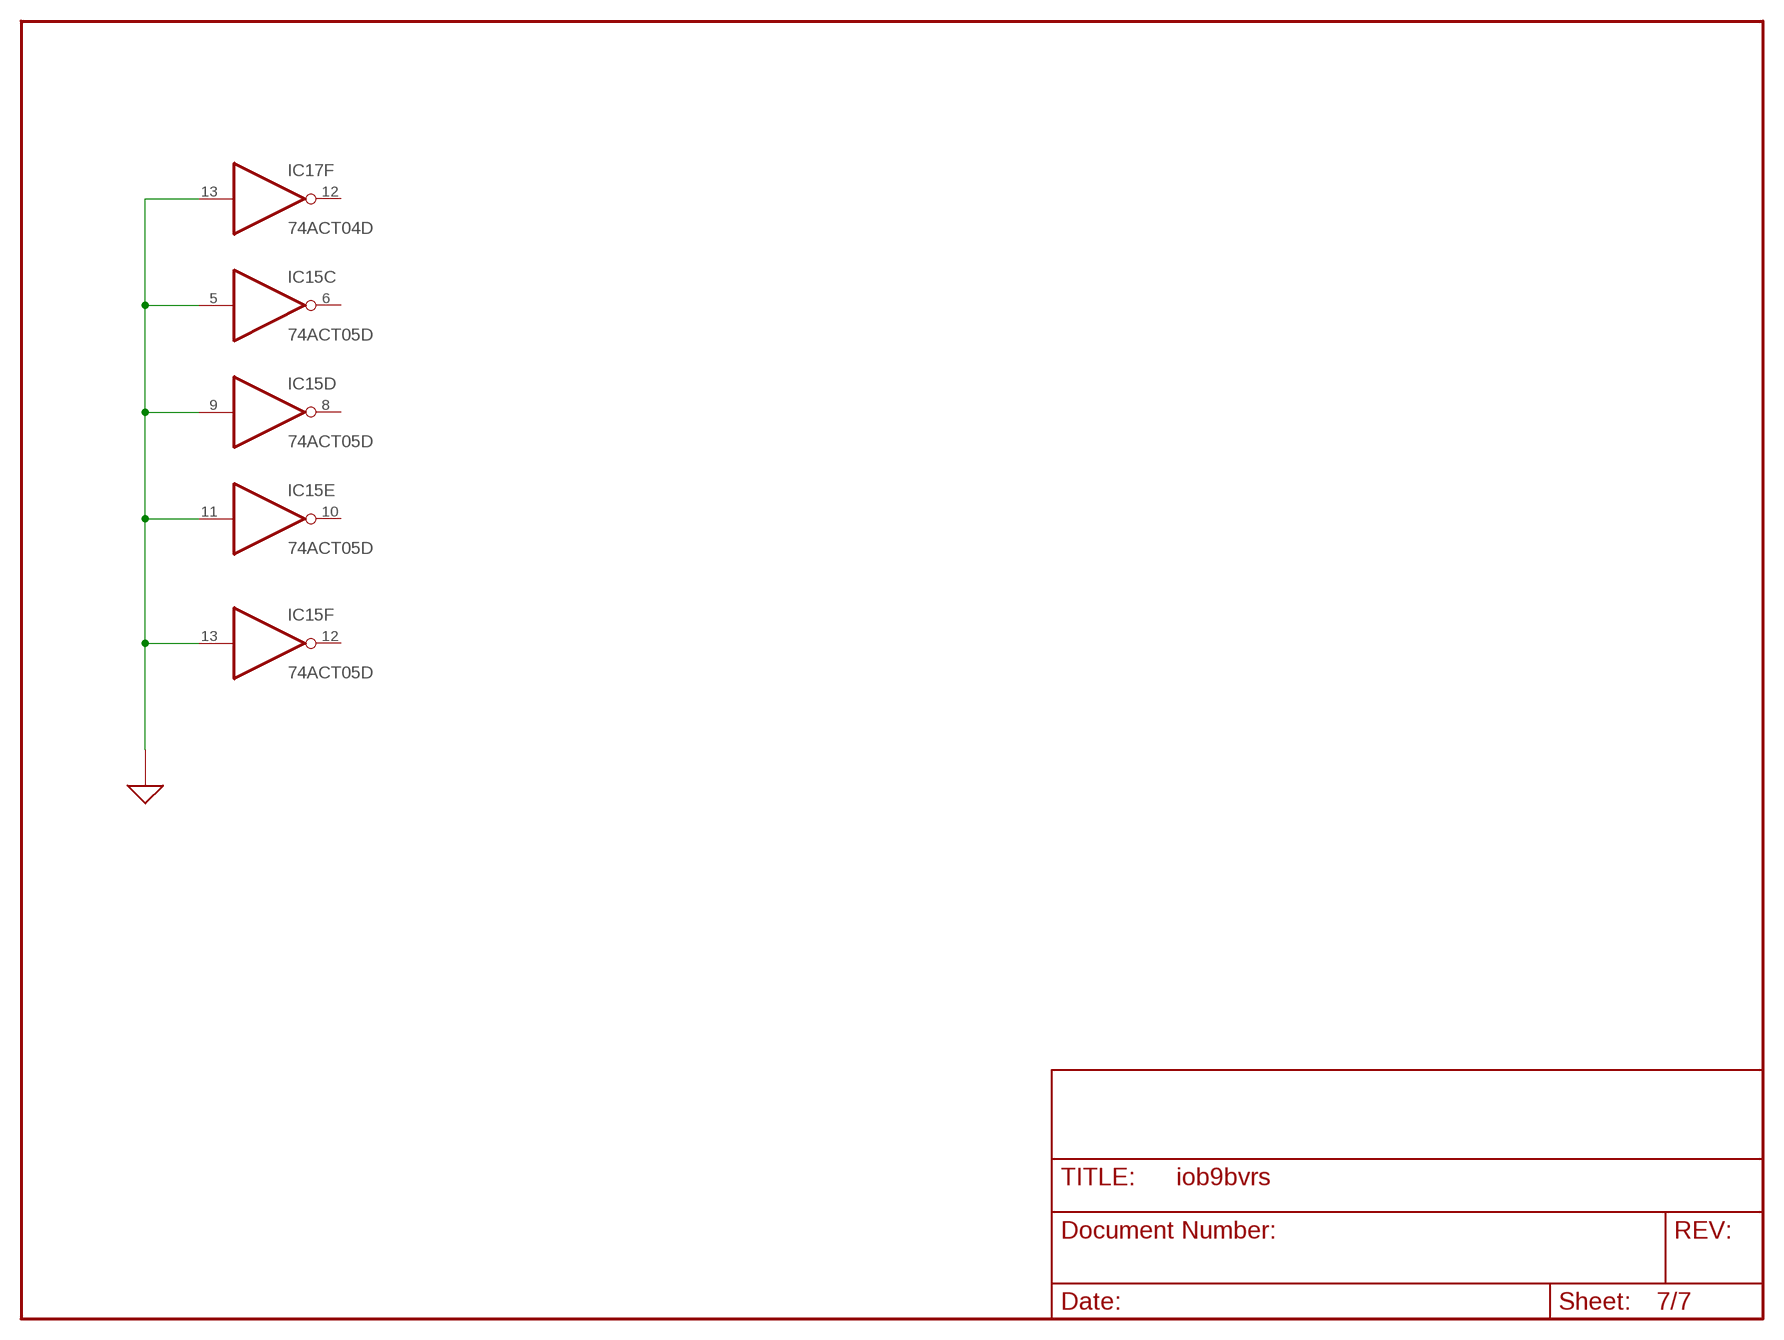
[diagram p6: schematic, sheet 7]

### Nets
GND [gnd]: IC15.5(C:I) IC15.9(D:I) IC15.11(E:I) IC15.13(F:I) IC17.13(F:I) ; also sheet 1,2,3,4,5,6
Unconnected: IC15.6(C:O) IC15.8(D:O) IC15.10(E:O) IC15.12(F:O) IC17.12(F:O)

## Power pins joined to a net without a drawn wire
2V5: IC12.9(2V5) IC12.14(2V5) IC12.24(2V5) IC12.55(2V5) IC12.82(2V5) IC12.92(2V5) IC12.97(2V5) IC12.125(2V5)
5V: IC16.1(5V) X1.P$4(5V)
GND: IC12.8(GND) IC12.17(GND) IC12.25(GND) IC12.33(GND) IC12.45(GND) IC12.52(GND) IC12.61(GND) IC12.73(GND) IC12.81(GND) IC12.89(GND) IC12.98(GND) IC12.110(GND) IC12.119(GND) IC12.128(GND) IC12.135(GND) IC12.143(GND) IC16.4(GND) X1.P$2(GND)
VCCO: IC12.1(VCCO) IC12.16(VCCO) IC12.35(VCCO) IC12.36(VCCO) IC12.53(VCCO) IC12.70(VCCO) IC12.71(VCCO) IC12.90(VCCO) IC12.107(VCCO) IC12.108(VCCO) IC12.127(VCCO) IC12.144(VCCO)

## Library data of the parts
BATA BATB = parts:CR2032
C1 C2 = rcl:CPOL-US: POLARIZED CAPACITOR, American symbol
C3-C17 C100-C107 = rcl:C-US: CAPACITOR, American symbol
CF1 = parts:CF_CMM_SOCKET2
CPREQ HS2 = jumper:JP1E: JUMPER
IC1 = parts:LH28F400
IC2-IC5 = parts:TC554001
IC6 = 74xx-us:74*138: 3-line to 8-line DECODER/DEMULTIPLEXER
IC7 = 74xx-eu:74*367: Hex BUS DRIVER, 3-state
IC8 = 74xx-us:74*373: Octal D type transparent LATCH, edge triggered
IC9 IC13 = 74xx-us:74*245: Octal BUS TRANSCEIVER, 3-state
IC10 = 74xx-us:74*32: Quad 2-input OR gate
IC11 = maxim:MAX208ECWG: RS232 TRANSEIVER
IC12 = parts:XC2S30-IOB1
IC14 = ds1321:DS1321: DS1321 Battery Monitor
IC15 = 74xx-us:74*05: Hex INVERTER, open collector
IC16 = parts:DS1302
IC17 = 74xx-us:74*04: Hex INVERTER
IO1 IO2 = con-lstb:MA13-2: PIN HEADER
J3 = jumper:JP2E: JUMPER
JTAG = con-lstb:MA03-2: PIN HEADER
KBD = mini_din:MINI_DIN_6
LPT = con-subd:F25?S: SUB-D
Q1 = crystal:CRYTAL: CRYSTAL
R1-R7 R9 R10 = rcl:R-US_: RESISTOR, American symbol
REG2.5 REG3.3 = parts:TPS77XXX
RN2 = parts:RN-4-SMT: 4 resistor package
SBC = con-harting-ml:ML50?E
SER1-SER3 = con-harting-ml:ML10: HARTING
SPKR = buzzer:KSS1201: SPEAKER Source: Schukat
VGA = con-subd:HF15: SUB-D
X1 = parts:OSC-OE-5V

## Net classes
1 power: width 0.254 mm, drill 0.381 mm, clearance 0.203 mm
2 gnd: width 0.254 mm, drill 0.381 mm
3 power2: width 0.254 mm, drill 0.381 mm